# Altium schematic sheet 10_Clock.SchDoc: Clock
size A3; Organization: Lime Microsystems; Address1: Surrey Tech Centre; Address2: Guildford GU2 7YG; Address3: Surrey; Address4: United Kingdom; Revision: v1.2; SheetNumber: 10; SheetTotal: 13
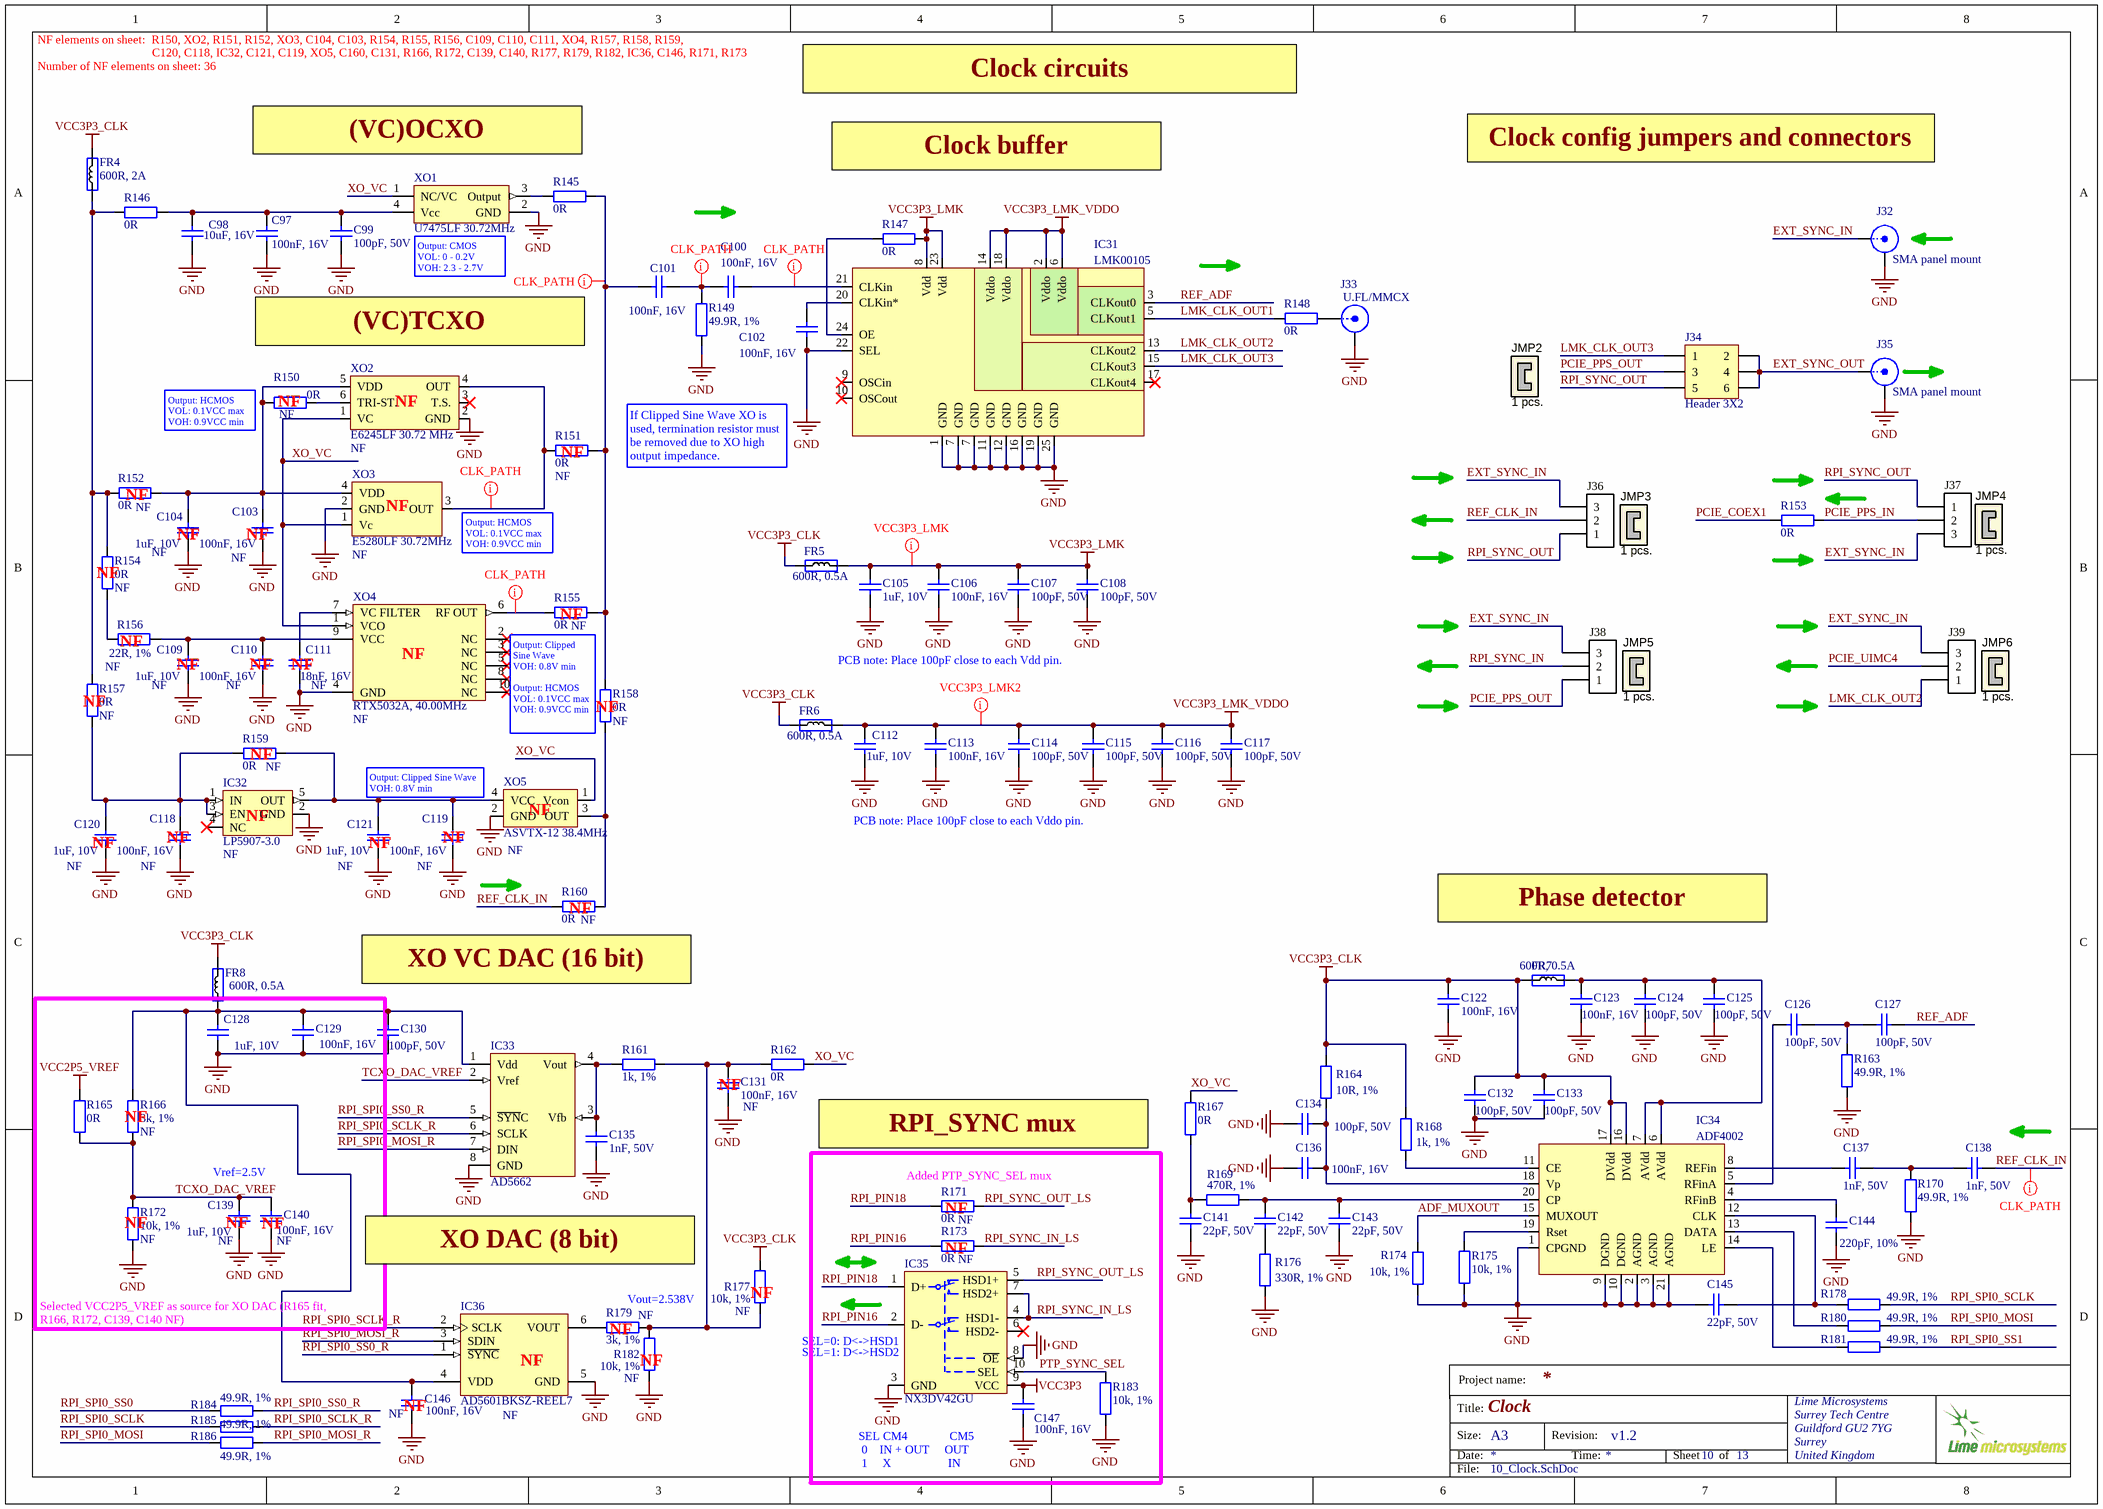
[diagram p0: 10_Clock.SchDoc]

## Parts
C97  100nF, 16V  [CAP0402]
C98  10uF, 16V  [CAP0603]
C99  100pF, 50V  [CAP0402]
C100  100nF, 16V  [CAP0402]
C101  100nF, 16V  [CAP0402]
C102  100nF, 16V  [CAP0402]
C103  100nF, 16V  Assembly Info: NF  [CAP0402]
C104  1uF, 10V  Assembly Info: NF  [CAP0402]
C105  1uF, 10V  [CAP0402]
C106  100nF, 16V  [CAP0402]
C107  100pF, 50V  [CAP0402]
C108  100pF, 50V  [CAP0402]
C109  1uF, 10V  Assembly Info: NF  [CAP0402]
C110  100nF, 16V  Assembly Info: NF  [CAP0402]
C111  18nF, 16V  Assembly Info: NF  [CAP0402]
C112  1uF, 10V  [CAP0402]
C113  100nF, 16V  [CAP0402]
C114  100pF, 50V  [CAP0402]
C115  100pF, 50V  [CAP0402]
C116  100pF, 50V  [CAP0402]
C117  100pF, 50V  [CAP0402]
C118  100nF, 16V  Assembly Info: NF  [CAP0402]
C119  100nF, 16V  Assembly Info: NF  [CAP0402]
C120  1uF, 10V  Assembly Info: NF  [CAP0402]
C121  1uF, 10V  Assembly Info: NF  [CAP0402]
C122  100nF, 16V  [CAP0402]
C123  100nF, 16V  [CAP0402]
C124  100pF, 50V  [CAP0402]
C125  100pF, 50V  [CAP0402]
C126  100pF, 50V  [CAP0402]
C127  100pF, 50V  [CAP0402]
C128  1uF, 10V  [CAP0402]
C129  100nF, 16V  [CAP0402]
C130  100pF, 50V  [CAP0402]
C131  100nF, 16V  Assembly Info: NF  [CAP0402]
C132  100pF, 50V  [CAP0402]
C133  100pF, 50V  [CAP0402]
C134  100pF, 50V  [CAP0402]
C135  1nF, 50V  [CAP0402]
C136  100nF, 16V  [CAP0402]
C137  1nF, 50V  [CAP0402]
C138  1nF, 50V  [CAP0402]
C139  1uF, 10V  Assembly Info: NF  [CAP0402]
C140  100nF, 16V  Assembly Info: NF  [CAP0402]
C141  22pF, 50V  [CAP0402]
C142  22pF, 50V  [CAP0402]
C143  22pF, 50V  [CAP0402]
C144  220pF, 10%  [CAP0402]
C145  22pF, 50V  [CAP0402]
C146  100nF, 16V  Assembly Info: NF  [CAP0402]
C147  100nF, 16V  [CAP0402]
FR4  600R, 2A  [RES0805]
FR5  600R, 0.5A  [RES0402]
FR6  600R, 0.5A  [RES0402]
FR7  600R, 0.5A  [RES0402]
FR8  600R, 0.5A  [RES0402]
IC31  LMK00105  [LMK00105SQ]
IC32  LP5907-3.0  Assembly Info: NF  [SOT23-5]
IC33  AD5662  [AD5662_SOT23-8]
IC34  ADF4002  [ADF4002]
IC35  NX3DV42GU  [FSUSB42UMX]
IC36  AD5601BKSZ-REEL7  Assembly Info: NF  [AD5601_SOT23-6]
J32  SMA panel mount  [SMA_connector_side]
J33  U.FL/MMCX  [MMCX_UFL_conn_u]
J34  Header 3X2  [Header3x2]
J35  SMA panel mount  [SMA_connector_side]
J36  Header 3x1 pin  [HDR_1x3]  (value not drawn)
J37  Header 3x1 pin  [HDR_1x3]  (value not drawn)
J38  Header 3x1 pin  [HDR_1x3]  (value not drawn)
J39  Header 3x1 pin  [HDR_1x3]  (value not drawn)
JMP2  1 pcs.  (mechanical)
JMP3  1 pcs.  (mechanical)
JMP4  1 pcs.  (mechanical)
JMP5  1 pcs.  (mechanical)
JMP6  1 pcs.  (mechanical)
R145  0R  [RES0402_v2]
R146  0R  [RES0402]
R147  0R  [RES0402]
R148  0R  [RES0402]
R149  49.9R, 1%  [RES0402]
R150  0R  Assembly Info: NF  [RES0402]
R151  0R  Assembly Info: NF  [RES0402_v2]
R152  0R  Assembly Info: NF  [RES0402]
R153  0R  [RES0402]
R154  0R  Assembly Info: NF  [RES0402]
R155  0R  Assembly Info: NF  [RES0402_v2]
R156  22R, 1%  Assembly Info: NF  [RES0402]
R157  0R  Assembly Info: NF  [RES0402]
R158  0R  Assembly Info: NF  [RES0402_v2]
R159  0R  Assembly Info: NF  [RES0402]
R160  0R  Assembly Info: NF  [RES0402_v2]
R161  1k, 1%  [RES0402]
R162  0R  [RES0402]
R163  49.9R, 1%  [RES0402]
R164  10R, 1%  [RES0402]
R165  0R  [RES0402_v2]
R166  3k, 1%  Assembly Info: NF  [RES0402]
R167  0R  [RES0402]
R168  1k, 1%  [RES0402]
R169  470R, 1%  [RES0402]
R170  49.9R, 1%  [RES0402]
R171  0R  Assembly Info: NF  [RES0402]
R172  10k, 1%  Assembly Info: NF  [RES0402]
R173  0R  Assembly Info: NF  [RES0402]
R174  10k, 1%  [RES0402]
R175  10k, 1%  [RES0402]
R176  330R, 1%  [RES0402]
R177  10k, 1%  Assembly Info: NF  [RES0402]
R178  49.9R, 1%  [RES0402]
R179  3k, 1%  Assembly Info: NF  [RES0402]
R180  49.9R, 1%  [RES0402]
R181  49.9R, 1%  [RES0402]
R182  10k, 1%  Assembly Info: NF  [RES0402]
R183  10k, 1%  [RES0402]
R184  49.9R, 1%  [RES0402]
R185  49.9R, 1%  [RES0402]
R186  49.9R, 1%  [RES0402]
XO1  U7475LF 30.72MHz  [AOCJYR-10.000MHz]
XO2  E6245LF 30.72 MHz  Assembly Info: NF  [RAKON_RPT7050A]
XO3  E5280LF 30.72MHz  Assembly Info: NF  [RAKON_TXCO]
XO4  RTX5032A, 40.00MHz  Assembly Info: NF  [RAKON_RTX5032A]
XO5  ASVTX-12 38.4MHz  Assembly Info: NF  [CRYSTAL_4-LCC_2P5x2P0]

## Blocks framed on the sheet
Vref=2.5V: C128 C129 C139 C140 R165 R166 R172

## Nets
GND: C97.1 C98.1 C99.2 C102.1 C103.1 C104.1 C105.1 C106.1 C107.1 C108.1 C109.1 C110.1 C111.1 C112.1 C113.1 C114.1 C115.1 C116.1 C117.1 C118.1 C119.1 C120.1 C121.1 C122.1 C123.1 C124.2 C125.2 C128.1 C129.2 C130.2 C131.1 C132.2 C133.2 C134.1 C135.2 C136.2 C139.1 C140.2 C141.1 C143.1 C144.2 C145.2 C146.2 C147.2 IC31.1(GND) IC31.7(GND) IC31.11(GND) IC31.12(GND) IC31.16(GND) IC31.19(GND) IC31.22(SEL) IC31.25(GND) IC32.2(GND) IC33.8(GND) IC34.1(CPGND) IC34.2(AGND) IC34.3(AGND) IC34.9(DGND) IC34.10(DGND) IC34.21(AGND) IC35.3(GND) IC35.8(~{OE}) IC36.5(GND) J32.2(Y) J33.2(Y) J35.2(Y) R149.1 R163.1 R170.1 R172.2 R174.2 R175.2 R176.1 R182.2 R183.2 XO1.2(GND) XO2.2(GND) XO3.2(GND) XO4.4(GND) XO5.2(GND)
VCC2P5_VREF: R165.2
VCC3P3: C147.1 IC35.9(VCC)
VCC3P3_CLK: C122.2 C132.1 C133.1 FR4.1 FR5.1 FR6.1 FR7.1 FR8.2 IC34.16(DVdd) IC34.17(DVdd) R164.2 R168.2 R177.1
VCC3P3_LMK: C105.2 C106.2 C107.2 C108.2 FR5.2 IC31.8(Vdd) IC31.23(Vdd) R147.2
VCC3P3_LMK_VDDO: C112.2 C113.2 C114.2 C115.2 C116.2 C117.2 FR6.2 IC31.2(Vddo) IC31.6(Vddo) IC31.14(Vddo) IC31.18(Vddo)
ADF_MUXOUT: IC34.15(MUXOUT) R174.1
EXT_SYNC_IN: J32.1(X) J36.3 J37.3 J38.3 J39.3
EXT_SYNC_OUT: J34.2 J34.4 J34.6 J35.1(X)
LMK_CLK_OUT1: IC31.5(CLKout1) R148.2
LMK_CLK_OUT2: IC31.13(CLKout2) J39.1
LMK_CLK_OUT3: IC31.15(CLKout3) J34.1
PCIE_COEX1: R153.2
PCIE_PPS_IN: J37.2 R153.1
PCIE_PPS_OUT: J34.3 J38.1
PCIE_UIMC4: J39.2
PTP_SYNC_SEL: IC35.10(SEL) R183.1
REF_ADF: C127.2 IC31.3(CLKout0)
REF_CLK_IN: C138.2 J36.2 R160.2
RPI_PIN16: IC35.2(D-) R173.2
RPI_PIN18: IC35.1(D+) R171.2
RPI_SPI0_MOSI: R180.1 R186.2
RPI_SPI0_MOSI_R: IC33.7(DIN) IC36.3(SDIN) R186.1
RPI_SPI0_SCLK: R178.1 R185.2
RPI_SPI0_SCLK_R: IC33.6(SCLK) IC36.2(SCLK) R185.1
RPI_SPI0_SS0: R184.2
RPI_SPI0_SS0_R: IC33.5(~{SYN}C) IC36.1(~{SYNC}) R184.1
RPI_SPI0_SS1: R181.1
RPI_SYNC_IN: J38.2
RPI_SYNC_IN_LS: IC35.4(HSD1-) IC35.7(HSD2+) R173.1
RPI_SYNC_OUT: J34.5 J36.1 J37.1
RPI_SYNC_OUT_LS: IC35.5(HSD1+) R171.1
TCXO_DAC_VREF: C139.2 C140.1 IC33.2(Vref) R165.1 R166.1 R172.1
XO_VC: R162.1 R167.2 XO1.1(NC/VC) XO2.1(VC) XO3.1(Vc) XO4.1(VCO) XO5.1(Vcon)
NetC97_2: C97.2 C98.2 C99.1 R146.2 XO1.4(Vcc)
NetC100_1: C100.1 IC31.21(CLKin)
NetC100_2: C100.2 C101.1 R149.2
NetC101_2: C101.2 R145.1 R151.1 R155.2 R158.1
NetC102_2: C102.2 IC31.20(CLKin*)
NetC103_2: C103.2 C104.2 R150.2 R152.1 XO2.5(VDD) XO3.4(VDD)
NetC109_2: C109.2 C110.2 R156.2 XO4.9(VCC)
NetC111_2: C111.2 XO4.7(VC_FILTER)
NetC118_2: C118.2 C120.2 IC32.1(IN) IC32.3(EN) R157.2 R159.2
NetC119_2: C119.2 C121.2 IC32.5(OUT) R159.1 XO5.4(VCC)
NetC123_2: C123.2 C124.1 C125.1 FR7.2 IC34.6(AVdd) IC34.7(AVdd)
NetC126_1: C126.1 IC34.5(RFinA)
NetC126_2: C126.2 C127.1 R163.2
NetC128_2: C128.2 C129.1 C130.1 C146.1 FR8.1 IC33.1(Vdd) IC36.4(VDD) R166.2
NetC131_2: C131.2 R161.1 R162.2 R177.2 R179.1 R182.1
NetC134_2: C134.2 C136.1 IC34.18(Vp) R164.1
NetC135_1: C135.1 IC33.3(Vfb) IC33.4(Vout) R161.2
NetC137_1: C137.1 IC34.8(REFin)
NetC137_2: C137.2 C138.1 R170.2
NetC141_2: C141.2 R167.1 R169.2
NetC142_1: C142.1 R176.2
NetC142_2: C142.2 C143.2 IC34.20(CP) R169.1
NetC144_1: C144.1 IC34.4(RFinB)
NetC145_1: C145.1 IC34.12(CLK) R178.2
NetFR4_2: FR4.2 R146.1 R152.2 R154.1 R157.1
NetIC31_24: IC31.24(OE) R147.1
NetIC34_11: IC34.11(CE) R168.1
NetIC34_13: IC34.13(DATA) R180.2
NetIC34_14: IC34.14(LE) R181.2
NetIC34_19: IC34.19(Rset) R175.1
NetIC36_6: IC36.6(VOUT) R179.2
NetJ33_1: J33.1(X) R148.1
NetR145_2: R145.2 XO1.3(Output)
NetR150_1: R150.1 XO2.6(TRI-ST.)
NetR151_2: R151.2 XO2.4(OUT) XO3.3(OUT)
NetR154_2: R154.2 R156.1
NetR155_1: R155.1 XO4.6(RF_OUT)
NetR158_2: R158.2 R160.1 XO5.3(OUT)

Not connected (* = marked no-connect by the designer): IC31 9(OSCin)* 10(OSCout)* 17(CLKout4)*; IC32 4(NC)*; IC35 6(HSD2-)*; JMP2 1 2; JMP3 1 2; JMP4 1 2; JMP5 1 2; JMP6 1 2; XO2 3(T.S.)*; XO4 2(NC)* 3(NC)* 5(NC)* 8(NC)* 10(NC)*

## Layout directives
net class CLK_PATH: NetC100_1, NetC100_2, NetC101_2, NetR151_2, NetR155_1, REF_CLK_IN
net class VCC3P3_LMK: VCC3P3_LMK
net class VCC3P3_LMK2: VCC3P3_LMK_VDDO

## Notes on the sheet
- NF elements on sheet:  R150, XO2, R151, R152, XO3, C104, C103, R154, R155, R156, C109, C110, C111, XO4, R157, R158, R159,
- Number of NF elements on sheet: 36
- C120, C118, IC32, C121, C119, XO5, C160, C131, R166, R172, C139, C140, R177, R179, R182, IC36, C146, R171, R173
- Clock circuits
- (VC)OCXO
- Clock buffer
- Clock config jumpers and connectors
- (near XO1) Output: CMOS
  VOL: 0 - 0.2V
  VOH: 2.3 - 2.7V
- (VC)TCXO
- (near R150) Output: HCMOS
  VOL: 0.1VCC max
  VOH: 0.9VCC min
- (near R150) NF
- (near XO2) NF
- (near R152) NF
- (near XO3) NF
- (near R151) NF
- (near R151) If Clipped Sine Wave XO is used, termination resistor must be removed due to XO high output impedance.
- (near R154) NF
- (near C104) NF
- (near C103) NF
- (near XO3) Output: HCMOS
  VOL: 0.1VCC max
  VOH: 0.9VCC min
- (near R156) NF
- (near R155) NF
- (near R157) NF
- (near C109) NF
- (near C110) NF
- (near C111) NF
- (near XO4) NF
- (near R158) NF
- PCB note: Place 100pF close to each Vdd pin.
- (near R159) NF
- (near R158) Output: Clipped Sine Wave
  VOH: 0.8V min
  Output: HCMOS
  VOL: 0.1VCC max
  VOH: 0.9VCC min
- (near C120) NF
- (near C118) NF
- (near IC32) NF
- (near C121) NF
- Output: Clipped Sine Wave
  VOH: 0.8V min
- (near C119) NF
- (near XO5) NF
- PCB note: Place 100pF close to each Vddo pin.
- (near R160) NF
- Phase detector
- XO VC DAC (16 bit)
- (near R166) NF
- (near C131) NF
- RPI_SYNC mux
- Added PTP_SYNC_SEL mux
- (near R172) NF
- (near C139) NF
- (near C140) NF
- XO DAC (8 bit)
- (near R171) NF
- (near R173) NF
- Selected VCC2P5_VREF as source for XO DAC (R165 fit, R166, R172, C139, C140 NF)
- Vout=2.538V
- (near R177) NF
- (near IC36) NF
- NF
- (near R182) NF
- (near IC35) SEL=0: D<->HSD1
- (near IC35) SEL=1: D<->HSD2
- (near C146) NF
- (near C147) SEL CM4              CM5
  0    IN + OUT     OUT
  1     X                   IN
- Project name:
- Title:
- Size:
- Date:
- A3
- Revision:
- Time:
- Sheet
- of
- File:

## Library data of the parts
C97 C100-C103 C106 C110 C113 C122 C123 C131 C136 C147 = Cap_0402: Manufacturer: Murata Electronics; Manufacturer Part Number: GRM155R71C104KA88D; Part Description: 0.10µF ±10% 16V Ceramic Capacitor X7R 0402 (1005 Metric); Tolerance: 10 %; Type: General Purpose MLCC; Capacitance: 0.1 uF; Case Length: 1 mm; Dielectric: X7R; Case Height: 0.5 mm; Temperature Coefficient / Code: +/- 15 %; Value: 100nF, 16V; Supplier 1: Mouser; Supplier Part Number 1: 81-GRM155R71C104KA88; Case Code - in: 0402; RoHS: RoHS Compliant; Operating Temperature Range: - 55 C to + 125 C; Series: GRM; Termination Style: SMD/SMT; Package / Case: 0402 (1005 metric); Voltage Rating DC: 16 V; Maximum Operating Temperature: + 125 C; Case Code - mm: 1005; Minimum Operating Temperature: - 55 C; Product Category: Low & Medium Capacitance SMD Ceramic Chip Capacitors; Packaging: Reel; Product: General Type MLCCs; Category: Multilayer Ceramic Capacitors MLCC - SMD/SMT; Brand: Murata Electronics; Case Width: 0.5 mm; RoHS - Mouser: Y; Standard Pack Qty: 10000; Minimum Order Quantity: 1; Reeling: True; Manufacturer Part Number 1: GRM155R71C104KA88D
C98 = Cap_0603: Manufacturer: Yageo; Manufacturer Part Number 1: GRM188R61C106MA73D; Part Description: 10µF ±20% 16V Ceramic Capacitor X5R 0603 (1608 Metric); Temperature Coefficient: X5R; Capacitance: 10µF; Tolerance: ±20%; Value: 10uF, 16V; Supplier 1: Digi-Key; Supplier Part Number 1: 490-7201-2-ND; Category: Capacitors; Ratings: -; Features: -; Lead Style: -; Package / Case: 0603 (1608 Metric); Lead Spacing: -; Applications: General Purpose; Voltage - Rated: 16V; Operating Temperature: -55°C ~ 85°C; Thickness (Max): 0.039" (1.00mm); Mounting Type: Surface Mount, MLCC; RoHS: RoHS Compliant; Size / Dimension: 0.063" L x 0.031" W (1.60mm x 0.80mm); Packaging: Tape & Reel (TR); Height - Seated (Max): -
C99 = Cap_0402: Manufacturer Part Number 1: CC0402JRNPO9BN101; Manufacturer: Yageo; Part Description: 100pF ±5% 50V C0G, NP0 Ceramic Capacitor -55°C ~ 125°C Surface Mount, MLCC 0402 (1005 Metric) 0.039" L x 0.020" W (1.00mm x 0.50mm); Tolerance: ±5%; Temperature Coefficient: C0G, NP0; Value: 100pF, 50V; Capacitance: 100pF; Thickness (Max): 0.022" (0.55mm); Size / Dimension: 0.039" L x 0.020" W (1.00mm x 0.50mm); RoHS: RoHS Compliant; Ratings: -; Package / Case: 0402 (1005 Metric); Mounting Type: Surface Mount, MLCC; Height - Seated (Max): -; Features: -; Lead Spacing: -; Voltage - Rated: 50V; Operating Temperature: -55°C ~ 125°C; Packaging: Cut Tape (CT); Applications: General Purpose; Lead Style: -; Supplier 1: Digi-Key; Category: Capacitors; Supplier Part Number 1: 311-1024-1-ND
C104 C109 = Cap_0402: CAP CER 1UF 10V X5R 0402; Manufacturer: Yageo; Part Description: 1µF 10V Ceramic Capacitor X5R 0402 (1005 Metric) 0.039" L x 0.020" W (1.00mm x 0.50mm); Manufacturer Part Number 1: CC0402MRX5R6BB105; Voltage Rating: 10; Capacitance: 1; Capacitance Tolerance: ± 10%; Ceramic Capacitor Case: 0402 [1005 Metric]; Dielectric Characteristic: X6; Product Range: TDK - C Series; Value: 1uF, 10V; Supplier 1: Digi-Key; Supplier Part Number 1: 311-1732-1-ND; RoHS: YES; MSL: -
C105 C112 C128 C139 = Cap_0402: CAP CER 1UF 10V X5R 0402; Manufacturer: Yageo; Part Description: 1µF 10V Ceramic Capacitor X5R 0402 (1005 Metric) 0.039" L x 0.020" W (1.00mm x 0.50mm); Manufacturer Part Number 1: CC0402MRX5R6BB105; Notification: Current market demand for these product types have resulted in fluctuating and extending lead times. Lead times may differ.; Tolerance: ±20%; Value: 1uF, 10V; Supplier 1: Digi-Key; Supplier Part Number 1: 311-1732-1-ND; RoHS: RoHS Compliant; Applications: General Purpose; Category: Capacitors; ComponentLink1Description: http://www.yageo.com/documents/recent/UPY-GPHC_X5R_4V-to-50V_25.pdf; ComponentLink1URL: http://www.yageo.com/documents/recent/UPY-GPHC_X5R_4V-to-50V_25.pdf; Failure Rate: -; Features: -; Height - Seated (Max): -; Lead Spacing: -; Lead Style: -; Mounting Type: Surface Mount, MLCC; Operating Temperature: -55°C ~ 85°C; Package / Case: 0402 (1005 Metric); Packaging: Cut Tape (CT); Part Status: Active; Pricing 1: 1=0.22, 10=0.156, 100=0.0732, 500=0.0513, 1000=0.04248, 2500=0.03953, 5000=0.03617 (USD); Ratings: -; Size / Dimension: 0.039" L x 0.020" W (1.00mm x 0.50mm); Stock 1: 69600; Temperature Coefficient: X5R; Thickness (Max): 0.022" (0.55mm); Voltage - Rated: 10V
C107 C108 C114-C117 = Cap_0402: Manufacturer Part Number 1: CC0402JRNPO9BN101; Manufacturer: Yageo; Part Description: 100pF ±5% 50V C0G, NP0 Ceramic Capacitor -55°C ~ 125°C Surface Mount, MLCC 0402 (1005 Metric) 0.039" L x 0.020" W (1.00mm x 0.50mm); Temperature Coefficient: C0G, NP0; Tolerance: ±5%; Value: 100pF, 50V; Supplier 1: Digi-Key; Supplier Part Number 1: 311-1024-1-ND; RoHS: RoHS Compliant; Category: Capacitors; Applications: General Purpose; Mounting Type: Surface Mount, MLCC; Capacitance: 100pF; Ratings: -; Packaging: Cut Tape (CT); Voltage - Rated: 50V; Size / Dimension: 0.039" L x 0.020" W (1.00mm x 0.50mm); Height - Seated (Max): -; Package / Case: 0402 (1005 Metric); Operating Temperature: -55°C ~ 125°C; Features: -; Lead Spacing: -; Lead Style: -; Thickness (Max): 0.022" (0.55mm)
C111 = Cap_0402: Manufacturer: Yageo; Manufacturer Part Number 1: CC0402KRX7R7BB183; Part Description: 0.018µF ±10% 16V Ceramic Capacitor X7R 0402 (1005 Metric); Temperature Coefficient: X7R; Capacitance: 0.018µF; Tolerance: ±10%; Value: 18nF, 16V; Supplier 1: Digi-Key; Supplier Part Number 1: 311-1706-1-ND; Part Status: Active; Category: Capacitors; Packaging: Cut Tape (CT); Voltage - Rated: 16V; RoHS: RoHS Compliant; Size / Dimension: 0.039" L x 0.020" W (1.00mm x 0.50mm); Package / Case: 0402 (1005 Metric); Mounting Type: Surface Mount, MLCC; Thickness (Max): 0.022" (0.55mm); Applications: General Purpose; Operating Temperature: -55°C ~ 125°C
C118 C119 = Cap_0402: Manufacturer: Murata Electronics; Manufacturer Part Number 1: GRM155R71C104KA88D; Part Description: 0.10µF ±10% 16V Ceramic Capacitor X7R 0402 (1005 Metric); Tolerance: 10 %; Type: General Purpose MLCC; Capacitance: 0.1 uF; Case Length: 1 mm; Dielectric: X7R; Case Height: 0.5 mm; Temperature Coefficient / Code: +/- 15 %; Value: 100nF, 16V; Supplier 1: Mouser; Supplier Part Number 1: 81-GRM155R71C104KA88; Case Code - in: 0402; RoHS: RoHS Compliant; Operating Temperature Range: - 55 C to + 125 C; Series: GRM; Termination Style: SMD/SMT; Package / Case: 0402 (1005 metric); Voltage Rating DC: 16 V; Maximum Operating Temperature: + 125 C; Case Code - mm: 1005; Minimum Operating Temperature: - 55 C; Product Category: Low & Medium Capacitance SMD Ceramic Chip Capacitors; Packaging: Reel; Product: General Type MLCCs; Category: Multilayer Ceramic Capacitors MLCC - SMD/SMT; Brand: Murata Electronics; Case Width: 0.5 mm; RoHS - Mouser: Y; Standard Pack Qty: 10000; Minimum Order Quantity: 1; Reeling: True; Manufacturer Part Number: GRM155R71C104KA88D
C120 C121 = Cap_0402: Manufacturer Part Number 1: CC0402MRX5R6BB105; Manufacturer: Yageo; Part Description: 1µF 10V Ceramic Capacitor X5R 0402 (1005 Metric) 0.039" L x 0.020" W (1.00mm x 0.50mm); Voltage Rating: 10; Capacitance Tolerance: ± 10%; Product Range: TDK - C Series; Ceramic Capacitor Case: 0402 [1005 Metric]; Capacitance: 1; Dielectric Characteristic: X6; Value: 1uF, 10V; Supplier 1: Digi-Key; Supplier Part Number 1: 311-1732-1-ND; MSL: -; RoHS: YES
C124-C127 C130 C132-C134 = Cap_0402: Manufacturer: Yageo; Manufacturer Part Number 1: CC0402JRNPO9BN101; Part Description: 100pF ±5% 50V C0G, NP0 Ceramic Capacitor -55°C ~ 125°C Surface Mount, MLCC 0402 (1005 Metric) 0.039" L x 0.020" W (1.00mm x 0.50mm); Temperature Coefficient: C0G, NP0; Tolerance: ±5%; Value: 100pF, 50V; Supplier 1: Digi-Key; Supplier Part Number 1: 311-1024-1-ND; Category: Capacitors; Features: -; Operating Temperature: -55°C ~ 125°C; Capacitance: 100pF; Thickness (Max): 0.022" (0.55mm); RoHS: RoHS Compliant; Voltage - Rated: 50V; Lead Style: -; Ratings: -; Size / Dimension: 0.039" L x 0.020" W (1.00mm x 0.50mm); Height - Seated (Max): -; Applications: General Purpose; Package / Case: 0402 (1005 Metric); Lead Spacing: -; Packaging: Cut Tape (CT); Mounting Type: Surface Mount, MLCC
C129 C140 = Cap_0603: Manufacturer Part Number 1: GRM155R71C104KA88D; Part Description: 0.10µF ±10% 16V Ceramic Capacitor X7R 0402 (1005 Metric); Brand: Murata Electronics; Tolerance: 10 %; Type: General Purpose MLCC; Capacitance: 0.1 uF; Temperature Coefficient / Code: +/- 15 %; Case Height: 0.5 mm; Case Length: 1 mm; Dielectric: X7R; Supplier 1: Mouser; Supplier Part Number 1: 81-GRM155R71C104KA88; Case Code - in: 0402; Manufacturer: Murata Electronics; Category: Multilayer Ceramic Capacitors MLCC - SMD/SMT; Voltage Rating DC: 16 V; Value: 100nF, 16V; Manufacturer Part Number: GRM155R71C104KA88D; Case Code - mm: 1005; Case Width: 0.5 mm; Maximum Operating Temperature: + 125 C; Minimum Operating Temperature: - 55 C; Minimum Order Quantity: 1; Operating Temperature Range: - 55 C to + 125 C; Package / Case: 0402 (1005 metric); Packaging: Reel; Product: General Type MLCCs; Product Category: Low & Medium Capacitance SMD Ceramic Chip Capacitors; Reeling: True; RoHS - Mouser: Y; RoHS: RoHS Compliant; Series: GRM; Standard Pack Qty: 10000; Termination Style: SMD/SMT
C135 C137 C138 = Cap_0402: Manufacturer: Murata Electronics North America; Part Description: 1000pF ±10% 50V Ceramic Capacitor X7R 0402 (1005 Metric); Manufacturer Part Number 1: GCM155R71H102KA37D; Temperature Coefficient: X7R; Tolerance: ±10%; Height - Seated (Max): -; Operating Temperature: -55°C ~ 125°C; Ratings: AEC-Q200; Package / Case: 0402 (1005 Metric); Lead Style: -; Size / Dimension: 0.039" L x 0.020" W (1.00mm x 0.50mm); Lead Spacing: -; Thickness (Max): 0.022" (0.55mm); Mounting Type: Surface Mount, MLCC; Features: -; Voltage - Rated: 50V; Applications: Automotive; Part Status: Active; Packaging: Cut Tape (CT); RoHS: RoHS Compliant; Category: Capacitors; Supplier Part Number 1: 490-4761-1-ND; Supplier 1: Digi-Key; Value: 1nF, 50V
C141-C143 C145 = Cap_0402: Manufacturer: Yageo; Manufacturer Part Number 1: CC0402JRNPO9BN220; Part Description: 22pF ±5% 50V C0G, NP0 Ceramic Capacitor -55°C ~ 125°C Surface Mount, MLCC 0402 (1005 Metric) 0.039" L x 0.020" W (1.00mm x 0.50mm); Tolerance: ±5%; Temperature Coefficient: C0G, NP0; Value: 22pF, 50V; Supplier 1: Digi-Key; Supplier Part Number 1: 311-1018-2-ND; Category: Capacitors; Voltage - Rated: 50V; Packaging: Tape & Reel (TR); RoHS: RoHS Compliant; Capacitance: 22pF; Operating Temperature: -55°C ~ 125°C; Mounting Type: Surface Mount, MLCC; Height - Seated (Max): -; Size / Dimension: 0.039" L x 0.020" W (1.00mm x 0.50mm); Ratings: -; Applications: General Purpose; Thickness (Max): 0.022" (0.55mm); Lead Spacing: -; Lead Style: -; Features: -; Package / Case: 0402 (1005 Metric)
C144 = Cap_0402: Manufacturer Part Number 1: CC0402KRX7R9BB221; Manufacturer: Yageo; Part Description: 220pF ±10% 50V X7R Ceramic Capacitor -55°C ~ 125°C Surface Mount, MLCC 0402 (1005 Metric) 0.039" L x 0.020" W (1.00mm x 0.50mm); Temperature Coefficient: X7R; Voltage - Rated: 50V; Value: 220pF, 10%; Supplier 1: Digi-Key; Supplier Part Number 1: 311-1035-2-ND; Category: Capacitors; Ratings: -; RoHS: RoHS Compliant; Packaging: Tape & Reel (TR); Mounting Type: Surface Mount, MLCC; Applications: General Purpose; Capacitance: 220pF; Tolerance: ±10%; Operating Temperature: -55°C ~ 125°C; Package / Case: 0402 (1005 Metric); Lead Spacing: -; Size / Dimension: 0.039" L x 0.020" W (1.00mm x 0.50mm); Thickness (Max): 0.022" (0.55mm); Height - Seated (Max): -; Lead Style: -; Features: -
C146 = Cap_0603: Manufacturer Part Number 1: GRM155R71C104KA88D; Part Description: 0.10µF ±10% 16V Ceramic Capacitor X7R 0402 (1005 Metric); Brand: Murata Electronics; Tolerance: 10 %; Type: General Purpose MLCC; Capacitance: 0.1 uF; Temperature Coefficient / Code: +/- 15 %; Supplier 1: Mouser; Supplier Part Number 1: 81-GRM155R71C104KA88; Case Code - in: 0402; Manufacturer: Murata Electronics; Category: Multilayer Ceramic Capacitors MLCC - SMD/SMT; Voltage Rating DC: 16 V; Value: 100nF, 16V; Manufacturer Part Number: GRM155R71C104KA88D
FR4 = Ferrite: Manufacturer Part Number 1: MPZ2012S601AT000; Manufacturer: TDK Corporation; Part Description: FERRITE BEAD 600 OHM 0805 1LN; DC Resistance (DCR): 100 mOhm Max; Filter Type: Differential Mode - Single; Impedance @ Frequency: 600 Ohm @ 100MHz; Supplier 1: Digi-Key; Supplier Part Number 1: 445-2206-2-ND; Value: 600R, 2A; Category: Filters; Current Rating: 2A; Height (Max): 0.041" (1.05mm); Mounting Type: Surface Mount; Package / Case: 0805 (2012 Metric); Packaging: Tape & Reel (TR); RoHS: RoHS Compliant; Size / Dimension: 0.079" L x 0.049" W (2.00mm x 1.25mm)
FR5-FR8 = Ferrite: Manufacturer: Murata; Manufacturer Part Number 1: BLM15AX601SN1D; Part Description: - Ferrite Bead 0402 (1005 Metric) 500mA 340mOhm; Tolerance: 25%; Current Rating: 500mA; Number of Lines: 1; DC Resistance (DCR): 340mR; Test Frequency: 100MHz; Value: 600R, 0.5A; Supplier 1: Digi-Key; Supplier Part Number 1: 490-5441-1-ND; Stock 1: 416370; Pricing 1: 1=0.1, 10=0.06, 25=0.0552, 50=0.0496, 100=0.0363, 250=0.0264, 500=0.0242, 1000=0.0209, 5000=0.0165 (USD); Case/Package: 0402; Number of Pins: 2; Case Code (Metric): 1005; Case Code (Imperial): 0402; Core Material: Ferrite; Material: Steel,Ferrite; Min Operating Temperature: -55°C; Max Operating Temperature: 125°C; Package Quantity: 1; Packaging: Tape and Reel; Series: BLM15AX_SN; Impedance: 600R; Max Current Rating: 500mA; Termination: SMD/SMT; Max DC Current: 500mA; Number of Circuits: 1; DC Resistance-Max: 340mR; Length: 1mm; Width: 0.5mm; Height: 0.5mm; Depth: 0.5mm; REACH SVHC: No SVHC; Lead Free: Lead Free; RoHS Compliant: Yes; ComponentLink1URL: https://www.murata.com/en-us/products/productdata/8796740059166/ENFA0018.pdf?src-supplier=Digi-Key; ComponentLink1Description: https://www.murata.com/en-us/products/productdata/8796740059166/ENFA0018.pdf?src-supplier=Digi-Key; ComponentLink2URL: http://search.murata.co.jp/Ceramy/image/img/PDF/ENG/L0110S0100BLM15AX_SN.pdf?src-supplier=Future+Electronics; ComponentLink2Description: http://search.murata.co.jp/Ceramy/image/img/PDF/ENG/L0110S0100BLM15AX_SN.pdf?src-supplier=Future+Electronics; ComponentLink3URL: http://www.produktinfo.conrad.com/datenblaetter/1100000-1199999/001171675-da-01-en-CHIP_DROSSEL0402_600R_420MA_1_0X0_5MM.pdf?src-supplier=Conrad; ComponentLink3Description: http://www.produktinfo.conrad.com/datenblaetter/1100000-1199999/001171675-da-01-en-CHIP_DROSSEL0402_600R_420MA_1_0X0_5MM.pdf?src-supplier=Conrad; ComponentLink4URL: http://www.produktinfo.conrad.com/datenblaetter/1100000-1199999/001172169-da-01-en-DROSSEL_0402_600R_1_0X0_5MM_10000ST.pdf?src-supplier=Conrad; ComponentLink4Description: http://www.produktinfo.conrad.com/datenblaetter/1100000-1199999/001172169-da-01-en-DROSSEL_0402_600R_1_0X0_5MM_10000ST.pdf?src-supplier=Conrad
IC31 = LMK00105: Manufacturer: Texas Instruments; Manufacturer Part Number 1: LMK00105SQ/NOPB; Part Description: IC CLK BUFFER 2:5 200MHZ 24WQFN; Frequency - Max: 200MHz; Voltage - Supply: 2.375 V ~ 3.45 V; Input: HCSL, LVCMOS, LVDS, LVPECL, LVTTL, SSTL, Crystal; Differential - Input:Output: Yes/No; Supplier 1: Digi-Key; Type: Fanout Buffer (Distribution), Multiplexer, Translator; Category: Integrated Circuits (ICs); Operating Temperature: -40°C ~ 85°C; Package / Case: 24-WFQFN Exposed Pad; Supplier Device Package: 24-WQFN (4x4); Supplier Part Number 1: LMK00105SQ/NOPBCT-ND
IC32 = LP5907: Manufacturer: Texas Instruments; Manufacturer Part Number 1: LP5907QMFX-3.0Q1; Part Description: Linear Voltage Regulator IC Positive Fixed 1 Output  250mA SOT-23-5; Number of Outputs: 1; Min Input Voltage: 2.2V; Max Input Voltage: 5.5V; Max Output Current: 250mA; Output Voltage: 3V; Dropout Voltage: 50mV; Polarity: Positive; Quiescent Current: 425uA; Accuracy: 2%; Output Type: Fixed; Supplier 1: Digi-Key; Stock 1: 90911; Pricing 1: 1 = 0,65000, 10 = 0,56000, 100 = 0,41820, 500 = 0,32858, 1000 = 0,25390 (USD); RoHS: Yes; Mount: Surface Mount; Case/Package: SOT-23-5; Min Operating Temperature: -40°C; Max Operating Temperature: 125°C; Packaging: Tape and Reel; Output Current: 250mA; Number of Regulators: 1; Radiation Hardening: No; Lead Free: Lead Free; ComponentLink1URL: https://datasheet.ciiva.com/48677/lp5907-q1-48677562.pdf?src-supplier=Avnet; ComponentLink1Description: https://datasheet.ciiva.com/48677/lp5907-q1-48677562.pdf?src-supplier=Avnet; Supplier Part Number 1: 296-40364-1-ND
IC33 = AD5662: Manufacturer: Analog Devices Inc.; Manufacturer Part Number 1: AD5662BRJZ-2REEL7; Part Description: IC DAC 16BIT BUFF V-OUT SOT23-8; Number of Bits: 16; Number of D/A Converters: 1; Settling Time: 10µs; Output Type: Voltage - Buffered; Differential Output: No; Data Interface: SPI, DSP; Reference Type: External; Voltage - Supply, Analog: 2.7 V ~ 5.5 V; INL/DNL (LSB): ±8, ±1 (Max); Architecture: String DAC; Supplier 1: Digi-Key; RoHS: RoHS Compliant; Category: Integrated Circuits (ICs); Stock 1: 2784; Pricing 1: 1=7.55, 10=6.821, 100=5.6469, 500=4.91722, 1000=4.28274 (USD); Packaging: Cut Tape (CT); Part Status: Active; Voltage - Supply, Digital: 2.7 V ~ 5.5 V; Operating Temperature: -40°C ~ 125°C; Package / Case: SOT-23-8; Supplier Device Package: SOT-23-8; ComponentLink1URL: http://www.analog.com/media/en/technical-documentation/data-sheets/AD5662.pdf; ComponentLink1Description: http://www.analog.com/media/en/technical-documentation/data-sheets/AD5662.pdf; Supplier Part Number 1: AD5662BRJZ-2REEL7CT-ND
IC34 = ADF4002: Manufacturer: Analog Devices Inc; Manufacturer Part Number 1: ADF4002BCPZ-RL7; Part Description: IC PLL FREQUENCY SYNTH 20-LFCSP; Ratio - Input:Output: 2:1; Differential - Input:Output: Yes/No; Input: CMOS, TTL; Voltage - Supply: 2.7 V ~ 3.3 V; Supplier 1: Digi-Key; Supplier: Digi-Key; Category: Integrated Circuits (ICs); Type: Clock/Frequency Synthesizer (RF), Phase Detector; Operating Temperature: -40°C ~ 85°C; Mounting Type: Surface Mount; Package / Case: 20-VFQFN Exposed Pad, CSP; Supplier Part Number 1: ADF4002BCPZ-RL7CT-ND
IC35 = FSUSB42UMX: Part Description: USB Switch IC 1 Channel 10-UMLP (1.8x1.4); Manufacturer: NXP Semiconductors; Manufacturer Part Number 1: NX3DV42GU,115; ComponentLink1URL: https://www.fairchildsemi.com/datasheets/FS/FSUSB42.pdf; ComponentLink1Description: https://www.fairchildsemi.com/datasheets/FS/FSUSB42.pdf; Supplier 1: Digikey; Supplier Part Number 1: 568-12388-1-ND; Stock 1: 3109; Pricing 1: 1=0,89, 10=0,781, 25=0,7336, 100=0,5987, 250=0,55612, 500=0,47328, 1000=0,37863 (USD); RoHS: Yes; ComponentLink2URL: http://www.mouser.com/ds/2/302/NX3DV42-1127466.pdf?src-supplier=Mouser; ComponentLink2Description: http://www.mouser.com/ds/2/302/NX3DV42-1127466.pdf?src-supplier=Mouser; ComponentLink3URL: http://www.nxp.com/documents/data_sheet/NX3DV42.pdf?src-supplier=Avnet; ComponentLink3Description: http://www.nxp.com/documents/data_sheet/NX3DV42.pdf?src-supplier=Avnet; ComponentLink4URL: http://www.nxp.com/documents/data_sheet/NX3DV42.pdf?src-supplier=Digikey; ComponentLink4Description: http://www.nxp.com/documents/data_sheet/NX3DV42.pdf?src-supplier=Digikey; ComponentLink5URL: https://www.nxp.com/docs/en/data-sheet/NX3DV42.pdf?src-supplier=Digikey; ComponentLink5Description: https://www.nxp.com/docs/en/data-sheet/NX3DV42.pdf?src-supplier=Digikey
IC36 = AD5601BKSZ-REEL7: Single 8-Bit nanoDAC with SPI Interface in LFCSP and SC70, 2.7 to 5.5 V, <100 uA, -40 to +125 degC, KS-6, Pb-Free, Reel; Generic Part Number: AD5601; Manufacturer: Analog Devices; Part Description: IC DAC 8BIT BUFF V-OUT SC70-6; # DAC Outputs: 1; Max V+: 5.5V; Op Pwr Diss: 550µW; Resolution (Bits): 8; Settling Time: 6µs; Single Supply: Yes; DatasheetVersion: Rev.F; PackageVersion: 072809-A; PackageReference: KS-6; PackageDescription: 6-Lead Thin Shrink Small Outline Transistor Package [SC70]; Supplier 1: Digi-Key; Supplier Part Number 1: AD5601BKSZ-REEL7TR-ND; Supplier 2: Digi-Key; Supplier Part Number 2: AD5601BKSZ-REEL7CT-ND; Supplier 3: Digi-Key; Supplier Part Number 3: AD5601BKSZ-REEL7DKR-ND; Supplier 4: Farnell; Supplier Part Number 4: 2312971; Supplier 5: Newark; Supplier Part Number 5: 59K4256; Supplier 6: Newark; Supplier Part Number 6: 67W3160; Supplier 7: Mouser; Supplier Part Number 7: 584-AD5601BKSZ-R7; Packing: Reel; RoHS: Y; Mounting Technology: Surface Mount; Code_JEDEC: MO-203-AB; PartNumber: AD5601BKSZ-REEL7; ComponentLink1Description: Manufacturer URL; ComponentLink1URL: http://www.analog.com/en/index.html; ComponentLink2Description: Datasheet; ComponentLink2URL: http://www.analog.com/static/imported-files/data_sheets/AD5601_5611_5621.pdf; ComponentLink3Description: Package Specification; ComponentLink3URL: http://www.analog.com/static/imported-files/packages/PKG_PDF/SC70(KS)/KS_6.pdf; ComponentLink4Description: Product URL; ComponentLink4URL: http://www.analog.com/en/digital-to-analog-converters/da-converters/ad5601/products/product.html; Manufacturer Part Number 1: AD5601BKSZ-REEL7
J32 J35 = RF_IF_connector: CONN SMA JACK STR 50OHM EDGE MNT; Manufacturer: Linx; Manufacturer Part Number 1: CONSMA002-L-G; Part Description: SMA Connector Receptacle, Female Socket 50Ohm Panel Mount, Through Hole, Right Angle Solder; Supplier 1: Digi-Key; Supplier Part Number 1: CONSMA002-L-G-ND; Stock 1: 815; Pricing 1: 1=4.08, 25=3.67, 100=3.32, 250=3.25, 500=3, 1000=2.80001, 2000=2.5875 (USD)
J33 = RF_IF_connector: CONN UMC RCPT STR 50 OHM SMD; Manufacturer: Molex, LLC; Manufacturer Part Number 1: 0734120110; Body Finish: Nickel; Body Material: Phosphor Bronze; Center Contact Material: Brass; Center Contact Plating: Gold; Connector Style: Ultra Miniature Coaxial; Connector Type: Jack, Male Pin; Contact Termination: Solder; Dielectric Material: Liquid Crystal Polymer (LCP); Frequency - Max: 6GHz; Impedance: 50 Ohm; Voltage Rating: 60V; Cable Group: -; Category: Connectors, Interconnects; Fastening Type: Snap-On; Features: -; Housing Color: Silver; Ingress Protection: -; Mounting Type: Surface Mount; Operating Temperature: -40°C ~ 90°C; Packaging: Cut Tape (CT); RoHS: RoHS Compliant; Shield Termination: Solder; Supplier 1: Digi-Key; Supplier Part Number 1: WM5587CT-ND; Part Description: CONN UMC RCPT STR 50 OHM SMD
J34 = Header 3X2: Header, 2-Pin, Dual row; Manufacturer 1: Adam Equipment; Manufacturer Part Number: PH2-06-UA; Part Description: Connector Header Through Hole 6 position 0.100" (2.54mm); ComponentLink1URL: http://uk.rs-online.com/webdocs/1406/0900766b81406898.pdf; ComponentLink1Description: http://uk.rs-online.com/webdocs/1406/0900766b81406898.pdf; ComponentLink2URL: https://www.verical.com/server-webapp/html/getDatasheet?partID=483857; ComponentLink2Description: https://www.verical.com/server-webapp/html/getDatasheet?partID=483857; ComponentLink3URL: http://www.farnell.com/cad/112195.pdf; ComponentLink3Description: http://www.farnell.com/cad/112195.pdf; Supplier 1: Digi-Key; Supplier Part Number 1: 2057-PH2-06-UA-ND; Stock 1: 59749; Pricing 1: 1=0,13000, 10=0,10400, 100=0,07640, 500=0,06326, 1000=0,05535, 5000=0,04744, 10000=0,04612 (USD); RoHS: Yes; Lead Free: Lead Free; ComponentLink4URL: https://datasheet.ciiva.com/16479/page-292-295-16479745.pdf?src-supplier=Future+Electronics; ComponentLink4Description: https://datasheet.ciiva.com/16479/page-292-295-16479745.pdf?src-supplier=Future+Electronics; Manufacturer: Adam Equipment; Manufacturer Part Number 1: PH2-06-UA
J36-J39 = Header3P: Header, 3-pin; Manufacturer 1: Wurth Electronics; Manufacturer Part Number: 61300311121; Part Description: Connector Header Through Hole 3 position 0.100" (2.54mm); Number of Positions: 3; Gender: Male; Connector Type: Male Pin; Pitch: 0.1inch; Supplier 1: Digi-Key; Supplier Part Number 1: 732-5316-ND; Stock 1: 95926; Pricing 1: 1=0,13000, 10=0,11300, 25=0,09400, 50=0,07900, 100=0,07100, 1000=0,06600 (USD); RoHS: Yes; Mount: Through Hole; Contact Plating: Gold; Contact Material: Copper; Color: Black; Number of Rows: 1; Packaging: Bulk; Termination: Solder; Number of Contacts: 3; Contact Mating Length: 0.236inch; REACH SVHC: Unknown; Lead Free: Lead Free; RoHS Compliant: Yes; ComponentLink1URL: http://www.farnell.com/cad/1737268.pdf?src-supplier=Element14; ComponentLink1Description: http://www.farnell.com/cad/1737268.pdf?src-supplier=Element14; ComponentLink2URL: https://katalog.we-online.de/em/datasheet/6130xx11121.pdf?src-supplier=Digi-Key; ComponentLink2Description: https://katalog.we-online.de/em/datasheet/6130xx11121.pdf?src-supplier=Digi-Key; Manufacturer: Wurth Electronics; Manufacturer Part Number 1: 61300311121
JMP2-JMP6 = JUMP_2P_CONN_HEADER: Shorting Jumper, 2-position, 1.27mm pitch; Part Description: 2 (1 x 2) Position Shunt Connector Black Closed Top 0.100" (2.54mm) Gold; Manufacturer: Sullins; Manufacturer Part Number 1: SPC02SYAN; Number of Positions: 2; Pitch: 0.1inch; Supplier 1: Digi-Key; Supplier Part Number 1: S9001-ND; Stock 1: 570741; Pricing 1: 1=0.1, 10=0.059, 25=0.044, 50=0.0378, 100=0.0365, 250=0.03152, 500=0.03024, 1000=0.02646, 2500=0.02394 (USD); Colour: Black; Contact Plating: Gold; Package Quantity: 1000; Packaging: Bulk; Height: 0.256inch; Lead Free: Lead Free; ComponentLink1URL: http://www.sullinscorp.com/images/SPC02SYAN-0-3293.pdf; ComponentLink1Description: http://www.sullinscorp.com/images/SPC02SYAN-0-3293.pdf; ComponentLink2URL: https://drawings-pdf.s3.amazonaws.com/11134.pdf; ComponentLink2Description: https://drawings-pdf.s3.amazonaws.com/11134.pdf
R145-R148 R150-R155 R157-R160 R162 R165 R167 R171 R173 = Res_0402: Manufacturer Part Number 1: RC0402JR-070RL; Manufacturer: Yageo; Part Description: RES SMD 0.0OHM JUMPER 1/16W 0402; Resistance (Ohms): 0.0; Tolerance: Jumper; Power (Watts): 0.063W, 1/16W; Value: 0R; Supplier 1: Digi-Key; Supplier Part Number 1: 311-0.0JRTR-ND; Category: Resistors; Temperature Coefficient: -; Features: Moisture Resistant; Supplier Device Package: 0402; Height: 0.016" (0.40mm); Package / Case: 0402 (1005 Metric); Operating Temperature: -55°C ~ 155°C; Size / Dimension: 0.039" L x 0.020" W (1.00mm x 0.50mm); Composition: Thick Film; Packaging: Tape & Reel (TR); Number of Terminations: 2; RoHS: RoHS Compliant
R149 R163 R170 R178 R180 R181 R184-R186 = Res_0402: Manufacturer: Samsung Electro-Mechanics America, Inc.; Part Description: RES SMD 49.9 OHM 1% 1/16W 0402; Manufacturer Part Number 1: RC1005F49R9CS; Temperature Coefficient: ±100ppm/°C; Resistance (Ohms): 49.9; Power (Watts): 0.063W, 1/16W; Number of Terminations: 2; Size / Dimension: 0.039" L x 0.020" W (1.00mm x 0.50mm); Supplier Device Package: 0402 (1005 Metric); RoHS: RoHS Compliant; Supplier Part Number 1: 1276-3469-6-ND; Features: -; Packaging: Digi-Reel®; Tolerance: ±1%; Height: 0.016" (0.40mm); Category: Resistors; Composition: Thick Film; Package / Case: 0402 (1005 Metric); Supplier 1: Digi-Key; Operating Temperature: -55°C ~ 155°C; Value: 49.9R, 1%
R156 = Res_0402: Part Description: RES SMD 22 OHM 1% 1/16W 0402; Manufacturer Part Number 1: RC0402FR-0722RL; Manufacturer: Yageo; Temperature Coefficient: ±100ppm/°C; Resistance (Ohms): 22; Supplier 1: Digi-Key; Supplier Part Number 1: 311-22.0LRTR-ND; Tolerance: ±1%; Supplier Device Package: 0402; Composition: Thick Film; Category: Resistors; Value: 22R, 1%
R161 R168 = Res_0402: Manufacturer: Stackpole Electronics Inc; Manufacturer Part Number 1: RMCF0402FT1K00; Part Description: RES SMD 1K OHM 1% 1/16W 0402; Temperature Coefficient: ±100ppm/°C; Power (Watts): 0.063W, 1/16W; Value: 1k, 1%; Supplier 1: Digi-Key; Supplier Part Number 1: RMCF0402FT1K00TR-ND; Resistance (Ohms): 1k; Packaging: Tape & Reel (TR); Category: Resistors; RoHS: RoHS Compliant; Tolerance: ±1%; Height: 0.016" (0.40mm); Number of Terminations: 2; Package / Case: 0402 (1005 Metric); Operating Temperature: -55°C ~ 155°C; Features: -; Composition: Thick Film; Supplier Device Package: 0402; Size / Dimension: 0.039" L x 0.020" W (1.00mm x 0.50mm)
R164 = Res_0402: Manufacturer: Stackpole Electronics; Manufacturer Part Number 1: RMCF0402FT10R0; Part Description: 10 Ohms ±1% 0.063W, 1/16W Chip Resistor 0402 (1005 Metric) Automotive AEC-Q200 Thick Film; Power Rating: 63mW; Temperature Coefficient: 100ppm/°C; Value: 10R, 1%; Supplier 1: Digi-Key; Supplier Part Number 1: RMCF0402FT10R0CT-ND; Stock 1: 4909487; Pricing 1: 1=0,10000, 10=0,01400, 100=0,00560, 1000=0,00253, 2500=0,00220, 5000=0,00181 (USD); RoHS: Yes; Mount: Surface Mount; Case/Package: 0402; Case Code (Metric): 1005; Case Code (Imperial): 0402; Contact Plating: Tin,Matte; Size Code: 0402; Min Operating Temperature: -55°C; Max Operating Temperature: 155°C; Resistance: 10R; Tolerance: 1%; Packaging: Tape and Reel; Resistor Type: Thick Film; Number of Terminations: 2; Max Power Dissipation: 63mW; Features: Automotive AEC-Q200; Series: RMCF; Construction: Rectangular; Length: 0.039inch; Width: 0.02inch; Height: 0.016inch; Depth: 0.5mm; Radiation Hardening: No; Lead Free: Lead Free; Military Standard: Not; RoHS Compliant: Yes; ComponentLink1URL: http://components.arrow.com/part/dataview/44988361S6966751N1174?src-supplier=Arrow+Electronics; ComponentLink1Description: http://components.arrow.com/part/dataview/44988361S6966751N1174?src-supplier=Arrow+Electronics; ComponentLink2URL: https://www.seielect.com/catalog/SEI-RMCF_RMCP.pdf?src-supplier=Avnet; ComponentLink2Description: https://www.seielect.com/catalog/SEI-RMCF_RMCP.pdf?src-supplier=Avnet; ComponentLink3URL: https://www.seielect.com/catalog/SEI-Packaging.pdf?src-supplier=Digi-Key; ComponentLink3Description: https://www.seielect.com/catalog/SEI-Packaging.pdf?src-supplier=Digi-Key; ComponentLink4URL: http://www.seielect.com/Catalog/SEI-RMCF_RMCP.pdf?src-supplier=Future+Electronics; ComponentLink4Description: http://www.seielect.com/Catalog/SEI-RMCF_RMCP.pdf?src-supplier=Future+Electronics
R166 R179 = Res_0402: Manufacturer: Vishay Dale; Part Description: RES SMD 3K OHM 1% 1/16W 0402; Manufacturer Part Number 1: CRCW04023K00FKED; Temperature Coefficient: ±100ppm/°C; Power (Watts): 0.063W, 1/16W; Value: 3k, 1%; Category: Resistors; Tolerance: ±1%; RoHS: RoHS Compliant; Composition: Thick Film; Number of Terminations: 2; Operating Temperature: -55°C ~ 155°C; Supplier Device Package: 0402 (1005 Metric); Supplier Part Number 1: 541-3.00KLCT-ND; Packaging: Cut Tape (CT); Supplier 1: Digi-Key; Package / Case: 0402 (1005 Metric); Features: Automotive AEC-Q200; Resistance (Ohms): 3k; Height: 0.016" (0.40mm); Size / Dimension: 0.039" L x 0.020" W (1.00mm x 0.50mm)
R169 = Res_0402: Manufacturer 1: Yageo; Manufacturer Part Number 1: RC0402FR-07470RL; Part Description: 470 Ohms ±1% 0.063W, 1/16W Chip Resistor 0402 (1005 Metric) Moisture Resistant Thick Film; Power Rating: 62.5mW; Temperature Coefficient: 100ppm/°C; Voltage Rating: 50V; Max Power Dissipation: 63mW; Value: 470R, 1%; Supplier 1: Digi-Key; Supplier Part Number 1: 311-470LRCT-ND; Stock 1: 1652476; Pricing 1: 1=0,10000, 10=0,01600, 100=0,00660, 1000=0,00299, 2500=0,00259, 5000=0,00214 (USD); RoHS: Yes; Case/Package: 0402; Case Code (Metric): 1005; Case Code (Imperial): 0402; Size Code: 0402; Min Operating Temperature: -55°C; Max Operating Temperature: 155°C; Packaging: Tape and Reel; Tolerance: 1%; Resistance: 470R; Number of Terminations: 2; Features: Moisture Resistant; Package Quantity: 1; Resistor Type: Thick Film; Termination: SMD/SMT; Series: RC; Resistance Tolerance: 1%; Construction: Rectangular; Length: 1mm; Width: 0.02inch; Height: 0.016inch; Depth: 0.5mm; Lead Free: Lead Free; REACH SVHC: Unknown; Military Standard: Not; RoHS Compliant: Yes; Manufacturer: Yageo
R172 R174 R175 R177 R182 R183 = Res_0402: Manufacturer: Yageo; Manufacturer Part Number 1: RC0402FR-0710KL; Part Description: RES SMD 10K OHM 1% 1/16W 0402; Temperature Coefficient: ±100ppm/°C; Power (Watts): 0.063W, 1/16W; Value: 10k, 1%; Supplier 1: Digi-Key; Supplier Part Number 1: 311-10.0KLRTR-ND; Resistance (Ohms): 10k; Packaging: Tape & Reel (TR); RoHS: RoHS Compliant; Package / Case: 0402 (1005 Metric); Tolerance: ±1%; Operating Temperature: -55°C ~ 155°C; Size / Dimension: 0.039" L x 0.020" W (1.00mm x 0.50mm); Number of Terminations: 2; Category: Resistors; Height: 0.016" (0.40mm); Supplier Device Package: 0402; Features: Moisture Resistant; Composition: Thick Film
R176 = Res_0402: Manufacturer: Yageo; Manufacturer Part Number 1: RC0402FR-07330RL; Part Description: 330 Ohms ±1% 0.063W, 1/16W Chip Resistor 0402 (1005 Metric) Moisture Resistant Thick Film; Power Rating: 62.5mW; Voltage Rating: 50V; Temperature Coefficient: 100ppm/°C; Max Power Dissipation: 63mW; Value: 330R, 1%; Supplier 1: Digi-Key; Supplier Part Number 1: 311-330LRCT-ND; Stock 1: 7298585; Pricing 1: 1=0,10000, 10=0,01500, 100=0,00610, 1000=0,00275, 2500=0,00239, 5000=0,00197 (USD); RoHS: Yes; Case/Package: 0402; Case Code (Metric): 1005; Case Code (Imperial): 0402; Size Code: 0402; Min Operating Temperature: -55°C; Max Operating Temperature: 155°C; Packaging: Tape and Reel; Resistance: 330R; Tolerance: 1%; Resistor Type: Thick Film; Number of Terminations: 2; Termination: SMD/SMT; Features: Moisture Resistant; Series: RC; Construction: Rectangular; Resistance Tolerance: 1%; Package Quantity: 1; Technology: THICK FILM; Length: 0.039inch; Width: 0.02inch; Height: 0.016inch; Depth: 0.5mm; REACH SVHC: Unknown; Military Standard: Not; Lead Free: Lead Free; RoHS Compliant: Yes; ComponentLink1URL: http://www.farnell.com/datasheets/2167052.pdf?src-supplier=Farnell; ComponentLink1Description: http://www.farnell.com/datasheets/2167052.pdf?src-supplier=Farnell; ComponentLink2URL: http://www.farnell.com/datasheets/2167052.pdf?src-supplier=Newark; ComponentLink2Description: http://www.farnell.com/datasheets/2167052.pdf?src-supplier=Newark; ComponentLink3URL: http://www.farnell.com/datasheets/1018594.pdf?src-supplier=Element14; ComponentLink3Description: http://www.farnell.com/datasheets/1018594.pdf?src-supplier=Element14
XO1 = AOCJYR-10.000MHz: Manufacturer: Rakon; Part Description: ROM9070SA 30.72MHz MERC+ 9x7 HOT RC2.5 3.3V PULL; Oscillator Output Compatibility: CMOS; Oscillator Case: SMD, 9.7mm x 7.5; Supply Voltage Nom: 3.3; Frequency Nom, MHz: 30.72; Frequency Stability +/-, ppb: 20; Manufacturer Part Number 1: U7475LF 30.72MHz; Supplier Part Number 1: U7475LF; Supplier 1: Rakon
XO2 = RPT7050A: Part Description: TCXO 30.72MHz, E6245LF; Manufacturer: Rakon; Manufacturer Part Number 1: E6245LF; Supplier 1: Rakon; Supplier Part Number 1: E6245LF
XO3 = TXCO: Part Description: TCXO 30.72MHz, E5280LF; Manufacturer: Rakon; Manufacturer Part Number 1: E5280LF; Supplier 1: Rakon; Supplier Part Number 1: E5280LF
XO4 = Rakon_RTX5032A: Part Description: RTX5032A 40MHz, High performance TCXO, With VC, Filter Enabled, 10-pin 5mm x 3.2 mm x 1.65 mm package; Manufacturer: Rakon; Manufacturer Part Number 1: RTX5032A; Supplier Part Number 1: RTX5032A; Supplier 1: RAKON
XO5 = ASVTX-12-A-38.400MHZ-H10-T_CRYSTAL: Oscillator Crystal; Manufacturer: Abracon; Part Description: 38.4MHz VCTCXO Clipped Sine Wave Oscillator 3V  4-SMD, No Lead; Operating Supply Voltage: 3V; Frequency Stability: 1ppm; Max Supply Current: 2.5mA; Supplier 1: Digi-Key; Manufacturer Part Number 1: ASVTX-12-A-38.400MHZ-H10-T; Stock 1: 1680; Pricing 1: 1 = 3,58000, 10 = 3,41000, 50 = 3,23960, 100 = 2,89850, 500 = 2,72800 (USD); RoHS: Yes; Mount: Surface Mount; Case/Package: SMD/SMT; Min Operating Temperature: -30°C; Max Operating Temperature: 85°C; Frequency: 38.4MHz; Package Quantity: 1000; Packaging: Tape and Reel; Termination: SMD/SMT; Length: 0.098inch; Height: 0.035inch; Width: 0.079inch; ComponentLink1URL: https://datasheet.ciiva.com/5466/astx12-asvtx12-8609-5466673.pdf?src-supplier=Mouser; ComponentLink1Description: https://datasheet.ciiva.com/5466/astx12-asvtx12-8609-5466673.pdf?src-supplier=Mouser; ComponentLink2URL: https://datasheet.ciiva.com/867/astx12-asvtx12-867453.pdf?src-supplier=Digi-Key; ComponentLink2Description: https://datasheet.ciiva.com/867/astx12-asvtx12-867453.pdf?src-supplier=Digi-Key; ComponentLink3URL: https://datasheet.ciiva.com/867/astx12-asvtx12-867454.pdf?src-supplier=Digi-Key; ComponentLink3Description: https://datasheet.ciiva.com/867/astx12-asvtx12-867454.pdf?src-supplier=Digi-Key; ComponentLink4URL: https://datasheet.ciiva.com/867/astx12-asvtx12-867455.pdf?src-supplier=Digi-Key; ComponentLink4Description: https://datasheet.ciiva.com/867/astx12-asvtx12-867455.pdf?src-supplier=Digi-Key; Supplier Part Number 1: 535-11790-1-ND